# EAGLE design 16197 (EAGLE 7.6.0)
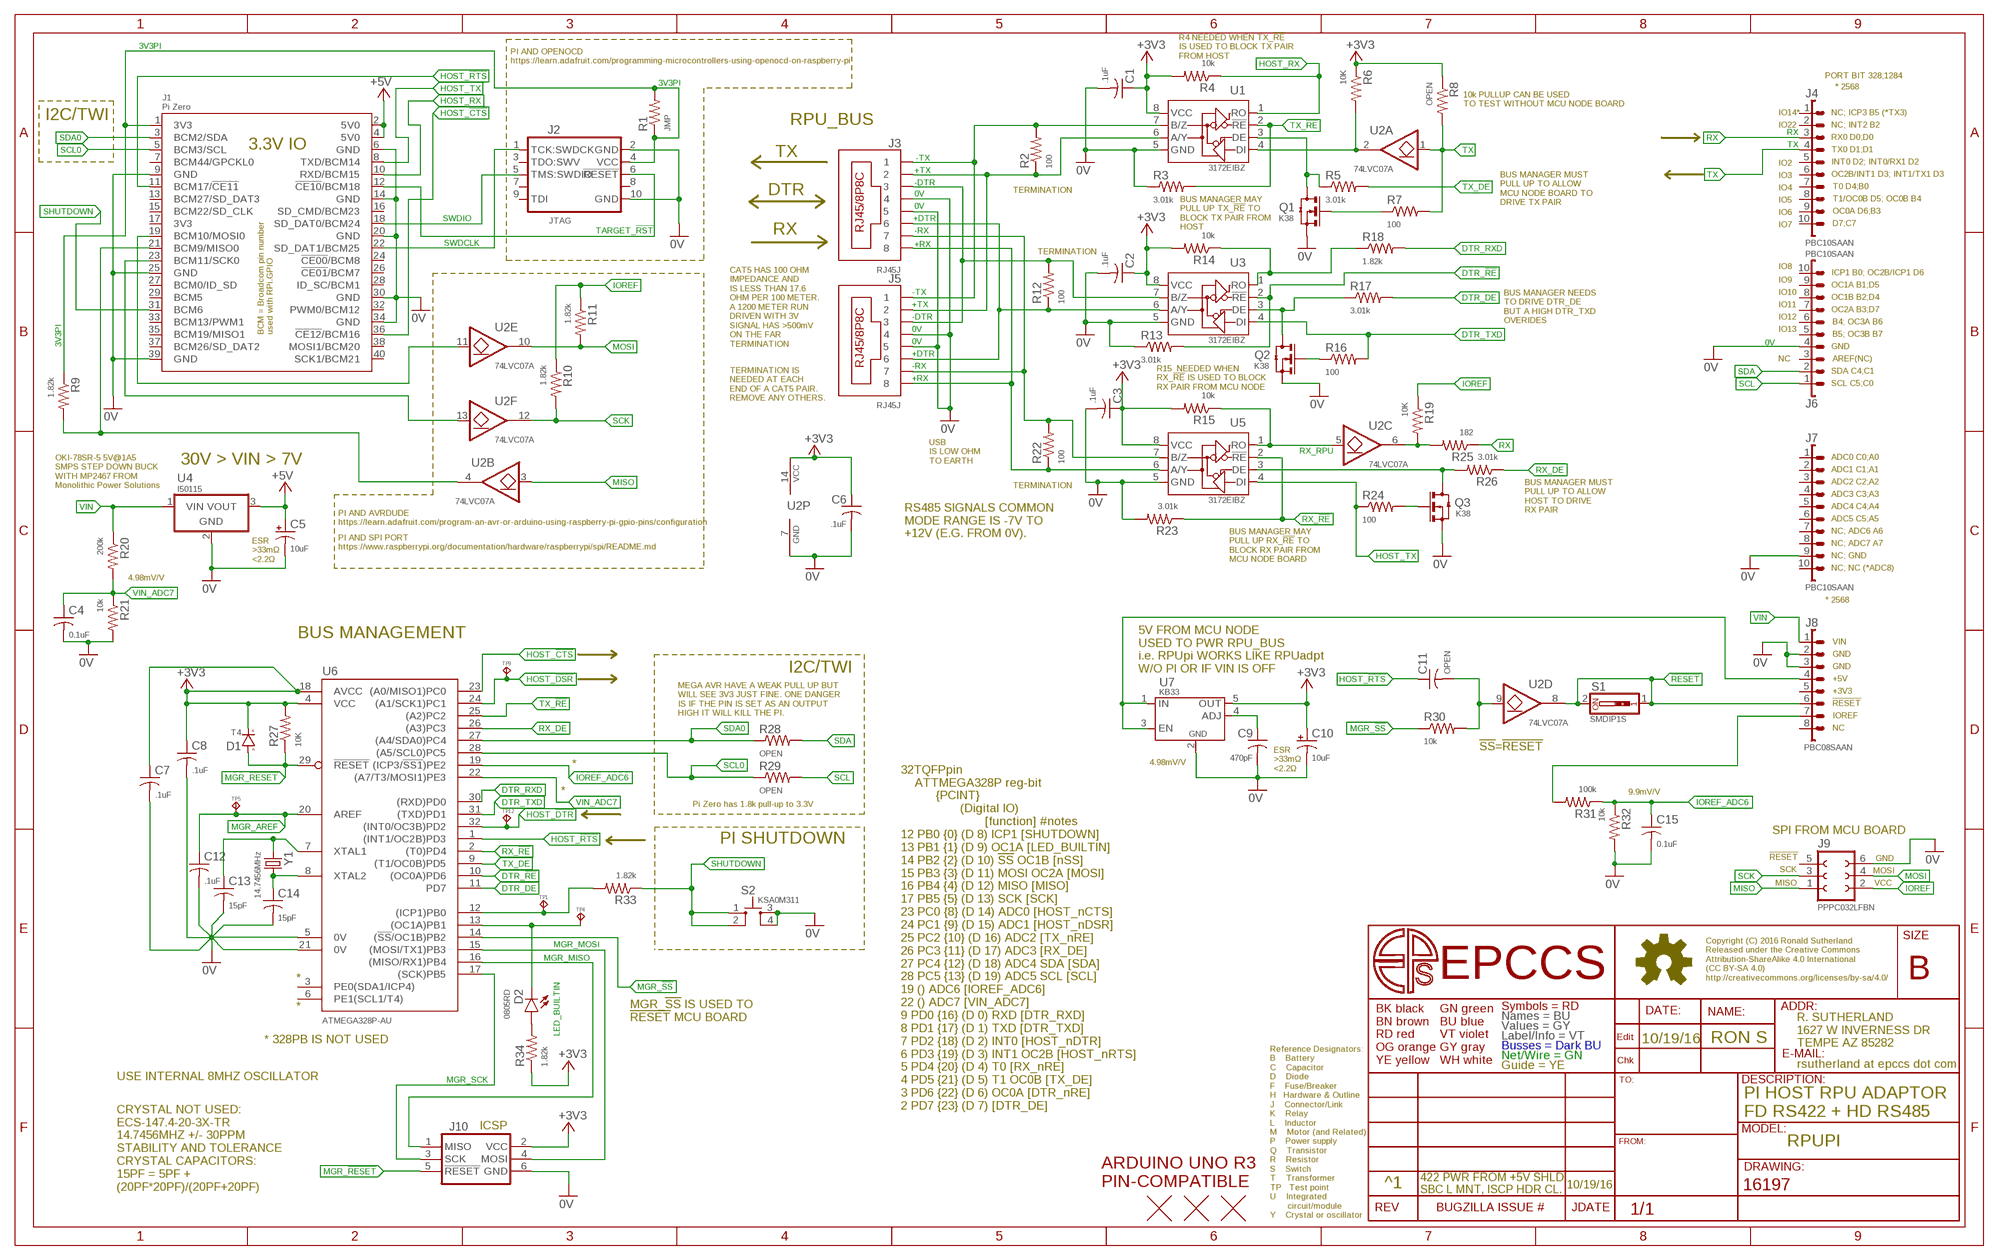
[diagram p0: schematic, sheet 1]

## Parts
C1  .1uF  CC0603A  [C0603(1608)]
C2  .1uF  CC0603A  [C0603(1608)]
C3  .1uF  CC0603A  [C0603(1608)]
C4  0.1uF  CC0603A  [C0603(1608)]
C5  10uF  CT1206  [3216]
C6  .1uF  CC0603A  [C0603(1608)]
C7  .1uF  CC0603A  [C0603(1608)]
C8  .1uF  CC0603A  [C0603(1608)]
C9  470pF  CC0603A  [C0603(1608)]
C10  10uF  CT1206  [3216]
C11  OPEN  CC0805A  [C0805(2012)]
C12  .1uF  CC0603A  [C0603(1608)]
C13  15pF  CC0603A  [C0603(1608)]
C14  15pF  CC0603A  [C0603(1608)]
C15  0.1uF  CC0603A  [C0603(1608)]
D1  T4  DSOD123  [SOD123]
D2  0805RD  LEDC0805(2012)  [C0805(2012)]
J1  Pi Zero  RPI-ZERO90  [RASPI_ZERO_V40PIN]
J2  JTAG  JTAG_SWD  [JTAG]
J3  RJ45J  RJ45-8HZT  [RJ45-8HZT]
J4  PBC10SAAN  1X10"  [1X10]
J5  RJ45J  RJ45-8HZT  [RJ45-8HZT]
J6  PBC10SAAN  1X10"  [1X10]
J7  PBC10SAAN  1X10"  [1X10]
J8  PBC08SAAN  1X8"  [1X8]
J9  PPPC032LFBN  F2X3  [F2X3]
J10  ISP-SPIPTH  [ISP]
Q1  K38  N-CHSOT23  [SOT23]
Q2  K38  N-CHSOT23  [SOT23]
Q3  K38  N-CHSOT23  [SOT23]
R1  JMP  R0805  [C0805(2012)]
R2  100  R0805  [C0805(2012)]
R3  3.01k  R0805  [C0805(2012)]
R4  10k  R0805  [C0805(2012)]
R5  3.01k  R0805  [C0805(2012)]
R6  10K  R0805  [C0805(2012)]
R7  100  R0805  [C0805(2012)]
R8  OPEN  R0805  [C0805(2012)]
R9  1.82k  R0805  [C0805(2012)]
R10  1.82k  R0805  [C0805(2012)]
R11  1.82k  R0805  [C0805(2012)]
R12  100  R0805  [C0805(2012)]
R13  3.01k  R0805  [C0805(2012)]
R14  10k  R0805  [C0805(2012)]
R15  10k  R0805  [C0805(2012)]
R16  100  R0805  [C0805(2012)]
R17  3.01k  R0805  [C0805(2012)]
R18  1.82k  R0805  [C0805(2012)]
R19  10K  R0805  [C0805(2012)]
R20  200k  R0805  [C0805(2012)]
R21  10k  R0805  [C0805(2012)]
R22  100  R0805  [C0805(2012)]
R23  3.01k  R0805  [C0805(2012)]
R24  100  R0805  [C0805(2012)]
R25  182  R0805  [C0805(2012)]
R26  3.01k  R0805  [C0805(2012)]
R27  10K  R0805  [C0805(2012)]
R28  OPEN  R0805  [C0805(2012)]
R29  OPEN  R0805  [C0805(2012)]
R30  10k  R0805  [C0805(2012)]
R31  100k  R0805  [C0805(2012)]
R32  10k  R0805  [C0805(2012)]
R33  1.82k  R0805  [C0805(2012)]
R34  1.82k  R0805  [C0805(2012)]
S1  SMDIP1S  SW_DIP-1SMD  [SMD-DIPSWITCH-1]
S2  KSA0M311  [0M311]
TP1  TPPAD1-08  [P1-08]
TP4  TPPAD1-08  [P1-08]
TP5  TPPAD1-08  [P1-08]
TP9  TPPAD1-08  [P1-08]
TP12  TPPAD1-08  [P1-08]
U1  3172EIBZ  ISL3172EIBZ  [SOIC8]
U2  74LVC07A  7407D  [14SOIC]
U3  3172EIBZ  ISL3172EIBZ  [SOIC8]
U4  I50115  OKI-78SR-H  [OKI-78SR-H]
U5  3172EIBZ  ISL3172EIBZ  [SOIC8]
U6  ATMEGA328P-AU  ATMEGA328PB-AU  [TQFP32-08]
U7  KB33  MIC5205  [SOT23-5,SOT25]
U$1  ARDUINO-UNO  [ARDUINO_UNO]
U$2  FIDUCIAL1.27  [FIDUCIAL-1.27]
U$3  FIDUCIAL1.27  [FIDUCIAL-1.27]
U$4  FIDUCIAL1.27  [FIDUCIAL-1.27]
Y1  14.7456MHz  CSM-3X  [CSM-3X]

## Nets
0V: C1.2 C2.2 C3.2 C4.2 C5.- C6.2 C7.2 C8.2 C9.2 C10.- C12.2 C13.2 C14.2 C15.2 J1.6(GND) J1.9(GND) J1.14(GND) J1.20(GND) J1.25(GND) J1.30(GND) J1.34(GND) J1.39(GND) J2.2(GND) J2.10(GND) J3.4 J3.5 J5.4 J5.5 J6.4 J7.9 J8.2 J8.3 J9.6 J10.6(GND) Q1.2(S)(S) Q2.2(S)(S) Q3.2(S)(S) R3.1 R13.1 R21.2 R23.2 R32.2 S2.3 S2.4 U1.5(GND) U2.7(P:GND) U3.5(GND) U4.2(GND) U5.5(GND) U6.5(0V) U6.21(0V) U7.2(GND)
3V3PI: J1.1(3V3) J2.4(VCC) R1.1 R1.2 R9.1
!RESET: J8.6 S1.1 S1.2 U2.8(D:O)
+3V3: C1.1 C2.1 C3.1 C6.1 C7.1 C8.1 C10.+ D1.C(K) J10.2(VCC) R4.2 R6.1 R8.1 R14.2 R15.2 R27.2 R34.1 U1.8(VCC) U2.14(P:VCC) U3.8(VCC) U5.8(VCC) U6.4(VCC) U6.18(AVCC) U7.5(OUT)
+5V: C5.+ J1.2(5V0) J1.4(5V0) U4.3(VOUT)
+DTR: J3.6 J5.6 R12.1 U3.6(A/Y)
+RX: J3.8 J5.8 R22.1 U5.6(A/Y)
+TX: J3.2 J5.2 R2.1 U1.6(A/Y)
-DTR: J3.3 J5.3 R12.2 U3.7(B/Z)
-RX: J3.7 J5.7 R22.2 U5.7(B/Z)
-TX: J3.1 J5.1 R2.2 U1.7(B/Z)
DTR_!RE: R13.2 U3.2(!RE) U6.10((OC0A)PD6)
DTR_DE: R17.2 U6.11(PD7)
DTR_RXD: R18.2 U6.30((RXD)PD0)
DTR_TXD: R16.2 U3.4(DI) U6.31((TXD)PD1)
HOST_!CTS: J1.36(!CE12!/BCM16) U6.23((A0/MISO1)PC0)
HOST_!DSR: TP9.TP U6.24((A1/SCK1)PC1)
HOST_!DTR: TP12.TP U6.32((INT0/OC3B)PD2)
HOST_!RTS: C11.1 J1.11(BCM17/!CE11!) U6.1((INT1/OC2B)PD3)
HOST_MISO: J1.21(BCM9/MISO0) R9.2 U2.4(B:O)
HOST_MOSI: J1.19(BCM10/MOSI0) U2.11(E:I)
HOST_RX: J1.10(RXD/BCM15) R4.1 U1.1(RO)
HOST_SCK: J1.23(BCM11/SCK0) U2.13(F:I)
HOST_TX: J1.8(TXD/BCM14) R24.1 U5.4(DI)
ICP1: R33.2 TP1.TP U6.12((ICP1)PB0)
IOREF: J9.2 R10.1 R11.1 R19.1
IOREF_ADC6: C15.1 R31.1 R32.1 U6.19((ICP3/!SS1!)PE2)
LED_BUILTIN: D2.K TP4.TP U6.13((OC1A)PB1)
MGR_!RESET: D1.A J10.5(!RESET) R27.1 U6.29(!RESET)
MGR_!SS!: R30.1 U6.14((!SS!/OC1B)PB2)
MGR_AREF: C12.1 TP5.TP U6.20(AREF)
MGR_MISO: J10.1(MISO) U6.16((MISO/RX1)PB4)
MGR_MOSI: J10.4(MOSI) U6.15((MOSI/TX1)PB3)
MGR_SCK: J10.3(SCK) U6.17((SCK)PB5)
MISO: J9.1 U2.3(B:I)
MOSI: J9.4 R11.2 U2.10(E:O)
N$2: C11.2 R30.2 U2.9(D:I)
N$3: J8.7 R31.2
N$10: R19.2 R25.2 U2.6(C:O)
N$11: Q3.3(D)(D) R26.2 U5.3(DE)
N$15: Q1.1(G)(G) R7.1
N$18: Q1.3(D)(D) R5.1 U1.3(DE)
N$19: R14.1 R18.1 U3.1(RO)
N$20: Q2.3(D)(D) R17.1 U3.3(DE)
N$22: Q2.1(G)(G) R16.1
N$24: C9.1 U7.4(ADJ)
N$25: Q3.1(G)(G) R24.2
N$29: D2.A R34.2
NODE5V: J8.4 U7.1(IN) U7.3(EN)
RX: J4.3 R25.1
RX_!RE: R23.1 U5.2(!RE) U6.2((T0)PD4)
RX_DE: R26.1 U6.26((A3)PC3)
RX_RPU: R15.1 U2.5(C:I) U5.1(RO)
SCK: J9.3 R10.2 U2.12(F:O)
SCL: J6.1 R29.2
SCL0: J1.5(BCM3/SCL) R29.1 U6.28((A5/SCL0)PC5)
SDA: J6.2 R28.2
SDA0: J1.3(BCM2/SDA) R28.1 U6.27((A4/SDA0)PC4)
SHUTDOWN: J1.31(BCM6) R33.1 S2.1 S2.2
SWDCLK: J1.22(SD_DAT1/BCM25) J2.1(TCK:SWDCK)
SWDIO: J1.18(SD_DAT0/BCM24) J2.5(TMS:SWDIO)
TARGET_!RST!: J1.12(!CE10!/BCM18) J2.6(!RESET)
TX: J4.4 R7.2 R8.2 U2.1(A:I)
TX_!RE: R3.2 U1.2(!RE) U6.25((A2)PC2)
TX_DE: R5.2 U6.9((T1/OC0B)PD5)
TX_RPU: R6.2 U1.4(DI) U2.2(A:O)
VIN: J8.1 R20.1 U4.1(VIN)
VIN_ADC7: C4.1 R20.2 R21.1 U6.22((A7/T3/MOSI1)PE3)
XTAL1: C13.1 U6.7(XTAL1) Y1.1
XTAL2: C14.1 U6.8(XTAL2) Y1.2
Unconnected: J1.7(BCM44/GPCKL0) J1.13(BCM27/SD_DAT3) J1.15(BCM22/SD_CLK) J1.16(SD_CMD/BCM23) J1.17(3V3) J1.24(!CE00!/BCM8) J1.26(!CE01!/BCM7) J1.27(BCM0/ID_SD) J1.28(ID_SC/BCM1) J1.29(BCM5) J1.32(PWM0/BCM12) J1.33(BCM13/PWM1) J1.35(BCM19/MISO1) J1.37(BCM26/SD_DAT2) J1.38(MOSI1/BCM20) J1.40(SCK1/BCM21) J2.3(TDO:SWV) J2.7(NC) J2.8(TRST) J2.9(TDI) J4.1 J4.2 J4.5 J4.6 J4.7 J4.8 J4.9 J4.10 J6.3 J6.5 J6.6 J6.7 J6.8 J6.9 J6.10 J7.1 J7.2 J7.3 J7.4 J7.5 J7.6 J7.7 J7.8 J7.10 J8.5 J8.8 J9.5 U6.3(PE0(SDA1/ICP4)) U6.6(PE1(SCL1/T4))

## Notes on the sheet
- R4 NEEDED WHEN TX_!RE! 
  IS USED TO BLOCK TX PAIR 
  FROM HOST
- PI AND OPENOCD
  https://learn.adafruit.com/programming-microcontrollers-using-openocd-on-raspberry-pi
- PORT BIT 328;1284
- * 2568
- 10k PULLUP CAN BE USED 
  TO TEST WITHOUT MCU NODE BOARD
- IO14* | NC; ICP3 B5 (*TX3)
- I2C/TWI
- RPU_BUS | IO22 | NC; INT2 B2
- RX0 D0;D0
- TX0 D1;D1
- TX
- IO2 | INT0 D2; INT0/RX1 D2
- IO3 | OC2B/INT1 D3; INT1/TX1 D3
- IO4 | T0 D4;B0
- DTR | TERMINATION
- IO5 | T1/OC0B D5; OC0B B4
- BUS MANAGER MUST
  PULL UP TO ALLOW 
  MCU NODE BOARD TO 
  DRIVE TX PAIR
- IO6 | OC0A D6;B3
- IO7 | D7;C7
- BUS MANAGER MAY
  PULL UP TX_!RE! TO 
  BLOCK TX PAIR FROM 
  HOST
- RX
- TERMINATION
- IO8
- ICP1 B0; OC2B/ICP1 D6
- IO9
- OC1A B1;D5
- IO10
- OC1B B2;D4
- IO11
- OC2A B3;D7
- IO12
- BUS MANAGER NEEDS
  TO DRIVE DTR_DE
  BUT A HIGH DTR_TXD
  OVERIDES
- B4; OC3A B6
- IO13
- B5; OC3B B7
- CAT5 HAS 100 OHM 
  IMPEDANCE AND 
  IS LESS THAN 17.6 
  OHM PER 100 METER. 
  A 1200 METER RUN
  DRIVEN WITH 3V 
  SIGNAL HAS >500mV
  ON THE FAR
  TERMINATION
- GND
- NC | AREF(NC)
- SDA C4;C1
- SCL C5;C0
- R15  NEEDED WHEN 
  RX_!RE! IS USED TO BLOCK 
  RX PAIR FROM MCU NODE
- TERMINATION IS 
  NEEDED AT EACH
  END OF A CAT5 PAIR.
  REMOVE ANY OTHERS.
- ADC0 C0;A0
- USB
  IS LOW OHM
  TO EARTH
- 30V > VIN > 7V
- ADC1 C1;A1
- ADC2 C2;A2
- OKI-78SR-5 5V@1A5
  SMPS STEP DOWN BUCK
  WITH MP2467 FROM 
  Monolithic Power Solutions
- TERMINATION
- ADC3 C3;A3
- ADC4 C4;A4
- BUS MANAGER MUST
  PULL UP TO ALLOW 
  HOST TO DRIVE
  RX PAIR
- ADC5 C5;A5
- PI AND AVRDUDE
  https://learn.adafruit.com/program-an-avr-or-arduino-using-raspberry-pi-gpio-pins/configuration
- NC; ADC6 A6
- RS485 SIGNALS COMMON 
  MODE RANGE IS -7V TO 
  +12V (E.G. FROM 0V).
- NC; ADC7 A7
- PI AND SPI PORT
  https://www.raspberrypi.org/documentation/hardware/raspberrypi/spi/README.md
- NC; GND
- ESR
  >33mΩ
  <2.2Ω
- BUS MANAGER MAY
  PULL UP RX_!RE! TO 
  BLOCK RX PAIR FROM
  MCU NODE BOARD
- NC; NC (*ADC8)
- 4.98mV/V
- * 2568
- BUS MANAGEMENT
- VIN
- GND
- GND
- I2C/TWI
- 5V FROM MCU NODE
  USED TO PWR RPU_BUS
  i.e. RPUpi WORKS LIKE RPUadpt
  W/O PI OR IF VIN IS OFF
- +5V
- +3V3
- !RESET
- MEGA AVR HAVE A WEAK PULL UP BUT 
  WILL SEE 3V3 JUST FINE. ONE DANGER 
  IS IF THE PIN IS SET AS AN OUTPUT 
  HIGH IT WILL KILL THE PI.
- IOREF
- NC
- !SS!=!RESET!
- * | 4.98mV/V
- ESR
  >33mΩ
  <2.2Ω
- * | 9.9mV/V
- Pi Zero has 1.8k pull-up to 3.3V
- SPI FROM MCU BOARD
- PI SHUTDOWN
- !RESET
- GND
- SCK
- MOSI
- MISO
- VCC
- *
- *
- MGR_!SS! IS USED TO
  !RESET! MCU BOARD
- * 328PB IS NOT USED | 10/19/16 | RON S
- USE INTERNAL 8MHZ OSCILLATOR
- 32TQFPpin
      ATTMEGA328P reg-bit
            {PCINT}
                   (Digital IO)
                          [function] #notes
  12 PB0 {0} (D 8) ICP1 [SHUTDOWN]
  13 PB1 {1} (D 9) OC1A [LED_BUILTIN]
  14 PB2 {2} (D 10) !SS! OC1B [nSS]
  15 PB3 {3} (D 11) MOSI OC2A [MOSI]
  16 PB4 {4} (D 12) MISO [MISO]
  17 PB5 {5} (D 13) SCK [SCK]
  23 PC0 {8} (D 14) ADC0 [HOST_nCTS]
  24 PC1 {9} (D 15) ADC1 [HOST_nDSR]
  25 PC2 {10} (D 16) ADC2 [TX_nRE]
  26 PC3 {11} (D 17) ADC3 [RX_DE]
  27 PC4 {12} (D 18) ADC4 SDA [SDA]
  28 PC5 {13} (D 19) ADC5 SCL [SCL]
  19 () ADC6 [IOREF_ADC6]
  22 () ADC7 [VIN_ADC7]
  9 PD0 {16} (D 0) RXD [DTR_RXD]
  8 PD1 {17} (D 1) TXD [DTR_TXD]
  7 PD2 {18} (D 2) INT0 [HOST_nDTR]
  6 PD3 {19} (D 3) INT1 OC2B [HOST_nRTS]
  5 PD4 {20} (D 4) T0 [RX_nRE]
  4 PD5 {21} (D 5) T1 OC0B [TX_DE]
  3 PD6 {22} (D 6) OC0A [DTR_nRE]
  2 PD7 {23} (D 7) [DTR_DE]
- PI HOST RPU ADAPTOR 
  FD RS422 + HD RS485
- ICSP
- RPUPI
- ^1 | 10/19/16
- CRYSTAL NOT USED:
  ECS-147.4-20-3X-TR
  14.7456MHZ +/- 30PPM
  STABILITY AND TOLERANCE
  CRYSTAL CAPACITORS:
  15PF = 5PF +
  (20PF*20PF)/(20PF+20PF)
- 422 PWR FROM +5V SHLD,
  SBC L MNT, ISCP HDR CL.

## Library data of the parts
C1-C4 C6-C9 C11-C15 = C-C:C: CAPACITOR Symbol
C5 C10 = C-T:CT: Tantalum Electrolytic Capacitor
D1 = D-GP:D: DIODE
D2 = D-LED:LED: LED 120120WH [CREE,XHGAWT-00-0000-00000HXE1] LED WHITE 6500K 150LUM-W120120
J1 = U-Pi:RPI-ZERO: Raspberry Pi Zero https://pinout.xyz/ NOTE: WiFi is needed see https://www.kickstarter.com/projects/1991736672/iot-hat-for-raspberry-pi-a-must-have-for-pi-zero
J2 = U-ARM:JTAG_SWD: JTAG layout that Atmel used for Atmel-ICE which works for both AVR and ARM devices
J3 J5 = J-RJ45:RJ45-8: RJ45 Jack RJ45J [ASSMANN,A-2014-2-4-R] JACK MODULAR VERT PCB 8P8C UNSHIELD Horz version form sparkfun sku PRT-00643, and breakout board sku is BOB-00716.
J4 J6 J7 = J-HDR2.54mm:1X10: 10 POS HEADER PBC10S [SULLINS,PBC10SAAN]HEADER MALE BRKWAY 10POS .1IN AA
J8 = J-HDR2.54mm:1X8: 8 POS HEADER PBC08SAAN [SULLINS,PBC08SAAN]HEADER MALE BRKWAY 8POS .1IN AA
J9 = J-HDR2.54mm:F2X3: FEMALE HEADER 2X3POS
J10 = U-AVR:ISP-SPI: AVR ISP thru SPI In-System Programming uses the target Atmel AVR’s internal SPI (Serial Peripheral Interface) to download code into the flash and EEPROM memories. It is not a debugging interface. When designing an application PCB which includes an AVR with the SPI interface, this pinout should be used. Sparkfun SKU: BOB-08508
Q1-Q3 = Q-NCH:N-CH?*: ENHANCEMENT MODE MOSFET SOT23 is BSS138 pinout
R1-R34 = R-C:R: Resiistor American-style symbol
S1 = S-Toggle:SW_DIP-1
S2 = S-Tactile:KSA: KSA0M311 [C&K,KSA0M311LFT] SWITCH TACTILE SEALED SPST-NO 50MA 32V
TP1 TP4 TP5 TP9 TP12 = J-TP:TP: Test pad
U1 U3 U5 = U-Transceiver:ISL3172E: TRANSCEIVER RS485 3.3V HALFDPLX
U2 = U-7400:74*07: HEX BUFFER, OPEN DRAIN/COLLECTOR 74LVC07A [DIODES,74LVC07AS14-13] LOGIC BUFFER OPEN DRAIN 14SOIC
U4 = P-DCDC:OKI-78SR: OKI-78SR OKI-78SR-5/1.5-W36H-C 5V@1.5A Horizontal Mount OKI-78SR-5/1.5-W36-C 5V@1.5A Vert Mount OKI-78SR-3.3/1.5-W36H-C 3.3V@1.5A Horizontal Mount OKI-78SR-3.3/1.5-W36-C 3.3V@1.5A Vert Mount Murata Power Solutions 7 to 36 VDC input range need to verify pinout
U6 = U-AVR:ATMEGA328PB-AU: ATmega328PB 4 Kbytes FLASH 128 bytes SRAM 256 bytes EEPROM 2 UART, 2 I2C, 2 SPI 8-channel 10 bit ADC
U7 = P-DCDC:MIC5205: KB33 [MICREL,MIC5205-3.3YM5] REG ULDO 3V3 150MA SOT23-5
U$1 = J-BoardHDR:ARDUINO-UNO: Board Outline with holes and silk note the board dim layer is not defined
U$2-U$4 = H-Fiducial:FIDUCIAL: Fiducial Alignment Points Various fiducial points for machine vision alignment.
Y1 = Y-XTL:CSM: 16MHZ20 [ECS,ECS-160-20-3X-TR] CRYSTAL 16MHZ 20PF 30PPM CSM-3X

## Net classes
0 default: width 0.254 mm, drill 0.33 mm

## Board
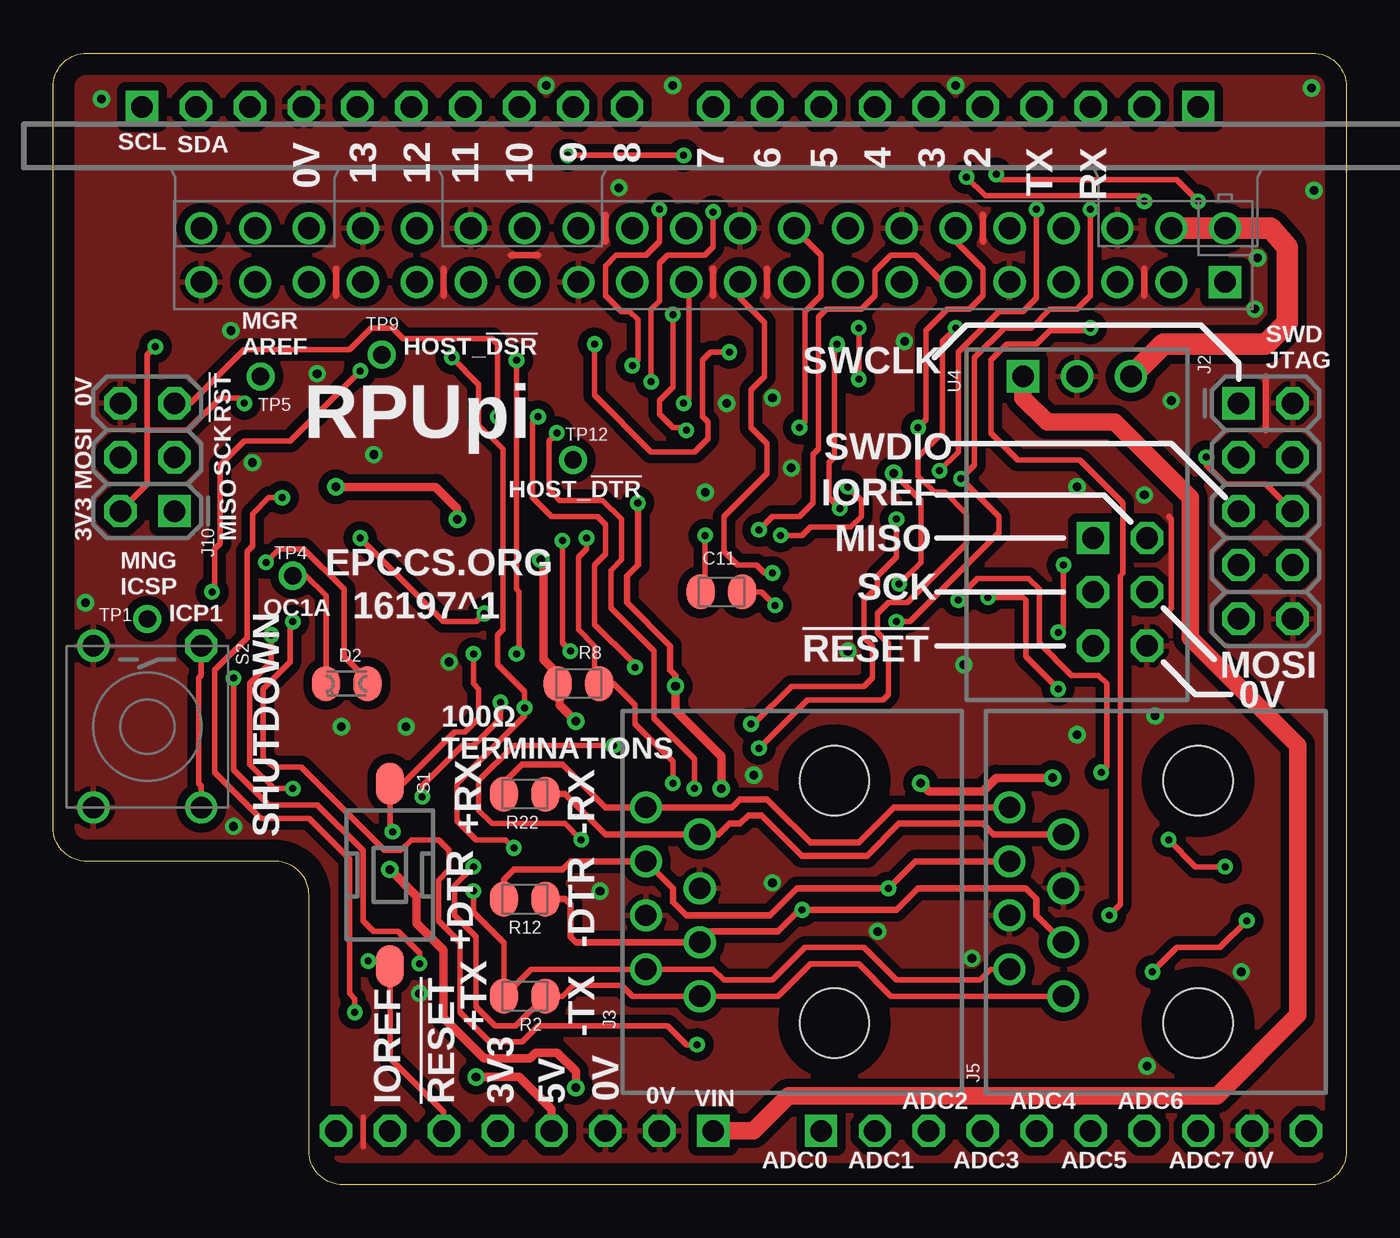
[diagram p1: board, top side]
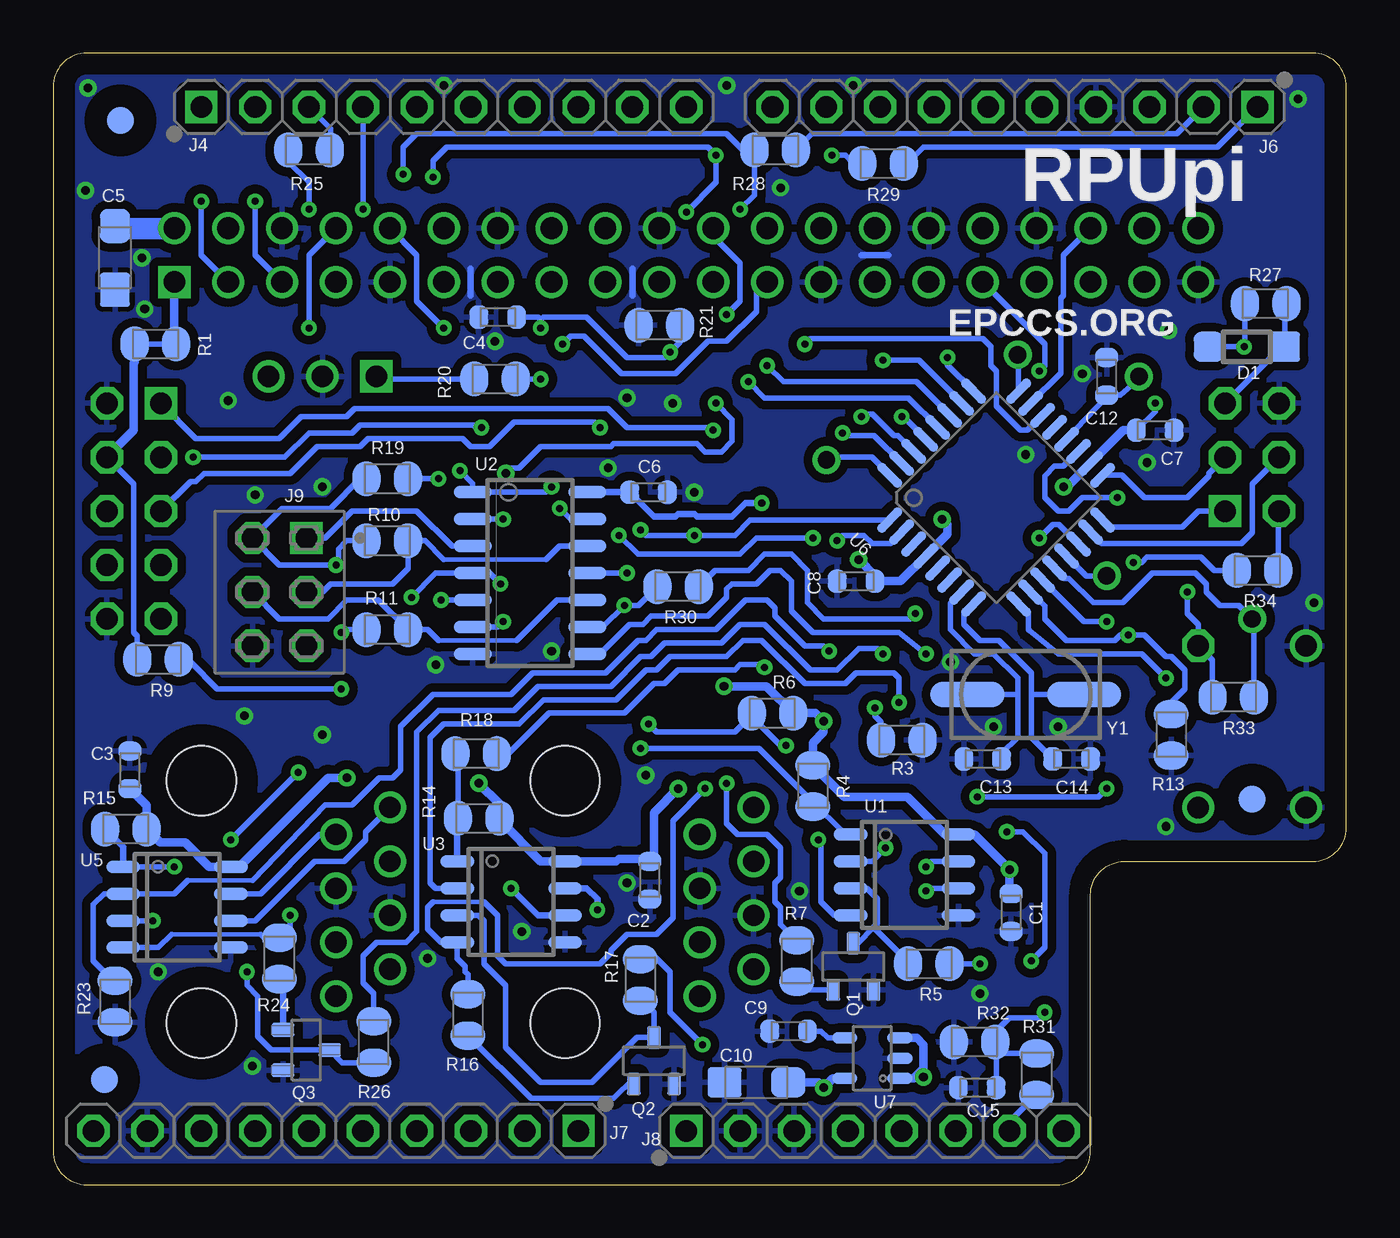
[diagram p2: board, bottom side, seen from below]

Size 60.96 x 53.34 mm. Coordinates in mm from the lower left corner, seen from the top.
Outline: 60.96,51.75 60.96,1.59 arc-90 59.37,0 13.65,0 arc-90 12.06,1.59 12.06,13.65 arc90 10.48,15.24 1.59,15.24 arc-90 0,16.83 0,51.75 arc-90 1.59,53.34 59.37,53.34 arc-90 60.96,51.75
Copper layers (1*16): Top 0.034290625mm / dielectric 60mil / Bottom 0.034290625mm
Design rules "default *": minimum track width 10mil, minimum drill 13mil, track to track 8mil, track to pad 8mil, pad to pad 8mil, via to via 8mil, smd to smd 8mil, copper to edge 40mil, drill to drill 12mil, minimum pad ring 10mil, minimum via ring 8mil, stop-mask expansion 4mil, vias tented up to drill 17mil, thermal gap 10mil

### Footprints (pad centres in the part's own frame; a part is rotated, then mirrored left to right if it is on the bottom)
C0603(1608) = smd 0.898 x 1.1: 1 -0.889,0; 2 0.889,0
3216 = smd 1.6 x 1.4: + -1.5,0; - 1.5,0
C0805(2012) = smd 1.321 x 1.651: 1 -0.977,0; 2 0.977,0
SOD123 = smd 1.4 x 1.4: A 1.8,0; C -1.8,0
C0805(2012)' = smd 1.321 x 1.651: A 0.977,0; K -0.977,0
RASPI_ZERO_V40PIN = drill 1.016 square: 1 0,2.54 | drill 1.016: 2 0,0; 3 2.54,2.54; 4 2.54,0; 5 5.08,2.54; 6 5.08,0; 7 7.62,2.54; 8 7.62,0; 9 10.16,2.54; 10 10.16,0; 11 12.7,2.54; 12 12.7,0; 13 15.24,2.54; 14 15.24,0; 15 17.78,2.54; 16 17.78,0; 17 20.32,2.54; 18 20.32,0; 19 22.86,2.54; 20 22.86,0; 21 25.4,2.54; 22 25.4,0; 23 27.94,2.54; 24 27.94,0; 25 30.48,2.54; 26 30.48,0; 27 33.02,2.54; 28 33.02,0; 29 35.56,2.54; 30 35.56,0; 31 38.1,2.54; 32 38.1,0; 33 40.64,2.54; 34 40.64,0; 35 43.18,2.54; 36 43.18,0; 37 45.72,2.54; 38 45.72,0; 39 48.26,2.54; 40 48.26,0
JTAG = drill 1.016 square: 1 0,0 | drill 1.016 octagon: 2 0,2.54; 3 2.54,0; 4 2.54,2.54; 5 5.08,0; 6 5.08,2.54; 7 7.62,0; 8 7.62,2.54; 9 10.16,0; 10 10.16,2.54
RJ45-8HZT = drill 1: 1 -4.445,6.35; 2 -3.175,8.89; 3 -1.905,6.35; 4 -0.635,8.89; 5 0.635,6.35; 6 1.905,8.89; 7 3.175,6.35; 8 4.445,8.89 | hole 3.264: -5.715,0; 5.715,0
1X10 = drill 1.016 square: 1 0,0 | drill 1.016 octagon: 2 2.54,0; 3 5.08,0; 4 7.62,0; 5 10.16,0; 6 12.7,0; 7 15.24,0; 8 17.78,0; 9 20.32,0; 10 22.86,0
1X8 = drill 1.016 square: 1 0,0 | drill 1.016 octagon: 2 2.54,0; 3 5.08,0; 4 7.62,0; 5 10.16,0; 6 12.7,0; 7 15.24,0; 8 17.78,0
F2X3 = drill 1.016 square: 1 0,0 | drill 1.016 octagon: 2 0,-2.54; 3 2.54,0; 4 2.54,-2.54; 5 5.08,0; 6 5.08,-2.54
ISP = drill 1.016 square: 1 0,0 | drill 1.016 octagon: 2 0,2.54; 3 2.54,0; 4 2.54,2.54; 5 5.08,0; 6 5.08,2.54
SOT23 = smd 0.65 x 1.06: 1(G) -0.95,-1.1; 2(S) 0.95,-1.1; 3(D) 0,1.1
SMD-DIPSWITCH-1 = smd 1.3 x 2: 1 0,-4.3; 2 0,4.3
0M311 = drill 1.016 octagon: 1 -3.81,2.54 | drill 1.016: 2 3.81,2.54; 3 -3.81,-2.54; 4 3.81,-2.54
P1-08 = drill 0.813: TP 0,0
SOIC8 = smd 0.6 x 1.6: 1 -1.905,-2.54; 2 -0.635,-2.54; 3 0.635,-2.54; 4 1.905,-2.54; 5 1.905,2.54; 6 0.635,2.54; 7 -0.635,2.54; 8 -1.905,2.54
14SOIC = smd 0.6 x 1.8: 1 -3.81,-2.7; 2 -2.54,-2.7; 3 -1.27,-2.7; 4 0,-2.7; 5 1.27,-2.7; 6 2.54,-2.7; 7 3.81,-2.7; 8 3.81,2.7; 9 2.54,2.7; 10 1.27,2.7; 11 0,2.7; 12 -1.27,2.7; 13 -2.54,2.7; 14 -3.81,2.7
OKI-78SR-H = drill 1.016 square: 1 0,0 | drill 1.016: 2 -2.54,0; 3 -5.08,0
TQFP32-08 = smd 1.5 x 0.45: 1 -4.293,2.8; 2 -4.293,2; 3 -4.293,1.2; 4 -4.293,0.4; 5 -4.293,-0.4; 6 -4.293,-1.2; 7 -4.293,-2; 8 -4.293,-2.8; 17 4.293,-2.8; 18 4.293,-2; 19 4.293,-1.2; 20 4.293,-0.4; 21 4.293,0.4; 22 4.293,1.2; 23 4.293,2; 24 4.293,2.8 | smd 0.45 x 1.5: 9 -2.8,-4.293; 10 -2,-4.293; 11 -1.2,-4.293; 12 -0.4,-4.293; 13 0.4,-4.293; 14 1.2,-4.293; 15 2,-4.293; 16 2.8,-4.293; 25 2.8,4.293; 26 2,4.293; 27 1.2,4.293; 28 0.4,4.293; 29 -0.4,4.293; 30 -1.2,4.293; 31 -2,4.293; 32 -2.8,4.293
SOT23-5,SOT25 = smd 0.55 x 1.2: 1 -0.95,-1.3; 2 0,-1.3; 3 0.95,-1.3; 4 0.95,1.3; 5 -0.95,1.3
FIDUCIAL-1.27 = smd 1.27 x 1.27: 1 0,0
CSM-3X = smd 3.5 x 1.2: 1 -2.75,0; 2 2.75,0

### Placement (x,y rotation side)
C1  15.81,12.83 270 bottom
C2  32.83,14.35 270 bottom
C3  57.34,19.56 90 bottom
C4  40,40.89 180 bottom
C5  58.04,43.69 270 bottom
C6  32.89,32.64 0 bottom
C7  9.02,35.56 0 bottom
C8  23.11,28.45 180 bottom
C9  26.29,7.24 180 bottom
C10  27.81,4.83 180 bottom
C11  31.5,27.94 0 top
C12  11.3,38.1 90 bottom
C13  17.15,20.07 180 bottom
C14  12.95,20.07 0 bottom
C15  17.4,4.57 180 bottom
D1  4.7,39.5 0 bottom
D2  0805RD  [C0805(2012)']  13.84,23.62 0 top
J1  55.24,45.09 180 top
J2  55.88,36.83 270 top
J3  36.83,13.34 90 top
J4  53.98,50.8 0 bottom
J5  53.98,13.34 90 top
J6  4.19,50.8 180 bottom
J7  36.2,2.54 180 bottom
J8  31.12,2.54 0 bottom
J9  49.02,30.48 270 bottom
J10  5.71,31.75 90 top
Q1  23.24,10.29 0 bottom
Q2  32.64,5.84 0 bottom
Q3  49.02,6.35 270 bottom
R1  56.13,39.62 0 bottom
R2  22.23,8.89 0 top
R3  20.96,20.95 180 bottom
R4  25.15,18.8 90 bottom
R5  19.69,10.41 0 bottom
R6  27.05,22.23 180 bottom
R7  25.91,10.54 90 bottom
R8  24.77,23.62 0 top
R9  56.01,24.77 0 bottom
R10  45.21,30.35 0 bottom
R11  45.21,26.16 0 bottom
R12  22.23,13.46 0 top
R13  8.26,21.21 90 bottom
R14  40.89,17.27 0 bottom
R15  57.53,16.76 0 bottom
R16  41.4,8 90 bottom
R17  33.27,9.65 90 bottom
R18  41.02,20.32 0 bottom
R19  45.21,33.27 0 bottom
R20  40.13,37.97 0 bottom
R21  32.38,40.51 180 bottom
R22  22.23,18.41 0 top
R23  58.04,8.64 270 bottom
R24  50.29,10.67 270 bottom
R25  48.89,48.77 180 bottom
R26  45.85,6.73 270 bottom
R27  3.81,41.53 180 bottom
R28  26.92,48.77 0 bottom
R29  21.84,48.13 0 bottom
R30  31.5,28.19 180 bottom
R31  14.61,5.21 270 bottom
R32  17.53,6.73 180 bottom
R33  5.33,22.99 0 bottom
R34  4.19,28.96 180 bottom
S1  15.88,14.61 0 top
S2  4.45,21.59 270 top
TP1  4.45,26.67 0 top
TP4  11.3,28.7 0 top
TP5  9.78,38.1 0 top
TP9  15.49,39.12 0 top
TP12  24.51,34.16 0 top
U1  20.83,14.61 270 bottom
U2  38.48,28.83 270 bottom
U3  39.37,13.34 270 bottom
U4  45.72,38.1 180 top
U5  55.12,13.08 270 bottom
U6  16.51,32.38 45 bottom
U7  22.35,5.97 90 bottom
U$1  -14.61,0 0 top  (outside the outline)
U$2  57.78,50.16 0 bottom
U$3  4.45,18.16 0 bottom
U$4  58.55,4.95 0 bottom
Y1  15.11,23.11 0 bottom

### Tracks (layer width: path | path; a pad name or v marks a point on that pad's centre or on a via)
0V  (via drill 0.41)
  Top 0.254: 14.61,1.78 14.61,3.17 | 52.58,31.5 52.7,31.37 52.7,27.18 52.58,27.05
  Top 0.305: 57.15,35.56 57.15,38.1 | 22.86,43.81 21.59,43.81 | 31.12,43.18 31.12,41.91 | 33.66,43.18 33.66,41.91 | 43.81,45.72 43.81,44.45 | 51.43,43.18 51.43,41.91 | 13.33,43.18 13.33,41.91 | 18.42,43.18 18.42,41.91 | 26.04,45.72 26.04,44.45
  Bottom 0.305: 21.59,43.81 22.86,43.81 | 33.66,43.18 33.66,41.91 | 41.27,43.18 41.27,41.91
  other vias: 9.4,34.04 12.45,38.23 2.29,51.18 23.24,51.82 29.21,51.82 42.54,51.82 59.31,51.69 56.01,10.03 51.94,22.1 51.43,32.51 42.93,24.51 30.73,32.64 48.26,21.21 51.56,5.59 13.59,21.59 16.64,21.59 18.67,24.64 38.86,11.94 1.52,27.43 8.51,16.89 37.46,25.15 8.38,40.26 48.26,32.89 15.11,34.42 52.7,36.96 56.64,41.27 56.77,43.69 59.44,46.86 26.67,46.99 31.75,36.83 34.8,33.78 33.91,37.08 40.13,39.75 17.27,9.02 33.02,19.3 33.91,14.22 25.78,13.84 43.31,10.67
  pour Top (isolate 0.406): 11.43,0 11.43,14.61 0,14.61 0,53.34 60.96,53.34 60.96,0
  pour Bottom (isolate 0.406): 0,53.34 60.96,53.34 60.96,0 11.43,0 11.43,14.61 0,14.61
3V3PI
  Bottom 0.254: R1.2 R1.1 | R9.1 56.98,25.87 57.15,26.04 57.15,33.02 J2.4
  Bottom 0.406: J1.1 55.24,40.17 R1.2 | R1.1 57.11,38.77 57.15,38.73 57.15,35.56 J2.4
!RESET  (via drill 0.33)
  Top 0.254: J8.6 18.42,3.43 15.88,5.97 S1.1 15.6,10.3 15.49,10.54 v14.86,10.54 | v19.81,25.02 19.81,23.62 20.07,23.37 20.07,21.97 19.43,21.34 18.92,21.34 16.51,18.92 15.89,18.92 S1.2 15.88,16.76 v16,16.64
  Bottom 0.254: U2.8 35.18,25.02 33.78,26.42 33.15,26.42 32.77,26.8 30.1,26.8 29.21,27.69 29.21,28.07 28.96,28.32 27.81,28.32 27.18,28.96 26.67,28.96 26.16,28.45 26.16,27.05 25.15,26.04 21.08,26.04 v19.81,25.02 | v14.86,10.54 14.22,11.18 14.22,15.62 15.24,16.64 v16,16.64
+3V3  (via drill 0.33, 0.41)
  Top 0.254: v9.02,36.83 8.76,37.08 7.87,37.08 6.35,35.56 4.45,35.56 | 4.45,35.56 4.45,33.02 J10.2 | v4.83,39.5 4.45,39.12 4.45,35.56
  Top 0.305: 23.88,22.77 23.88,22.61 | v29.34,23.5 29.34,24 29.08,24.26 29.08,25.4 27.05,27.43 27.05,28.7 27.56,29.21 v27.56,32.13
  Top 0.406: 23.88,22.77 R8.1 23.79,24.09 23.11,24.77 23.11,29.34 v22.99,29.46 | 23.88,22.61 v24.64,21.84 | v24.64,4.57 24.64,5.33 23.75,6.22 22.73,6.22 22.48,5.97 20.32,5.97 18.42,7.87 18.42,11.05 17.15,12.32 17.15,13.59 v15.88,14.86 | v31.5,18.67 31.5,20.19 29.34,22.35 v29.34,23.5 | v13.33,32.89 18.03,32.89 19.05,31.88 v19.05,31.37 | v40.89,18.92 41.27,18.54 43.81,18.54 44.45,19.18 v47.12,19.18
  Bottom 0.254: R34.1 3.21,31.71 J10.2 | 32.89,15.37 33.53,15.37 | C7.1 9.02,36.45 v9.02,36.83 | R27.2 4.79,39.54 v4.83,39.5 D1.C
  Bottom 0.305: R14.2 39.92,17.18 | v27.56,32.13 28.32,32.13 28.96,31.5 30.61,31.5 30.73,31.62 31.5,31.62 31.62,31.5 32.64,31.5 C6.1 U2.14
  Bottom 0.406: C7.1 10.51,35.56 U6.18 13.17,32.89 v13.33,32.89 | 39.92,17.18 37.97,15.24 U3.8 34.42,15.24 34.29,15.37 32.89,15.37 | U7.5 24.19,5.02 v24.64,4.57 24.89,4.83 C10.+ | C1.1 15.88,13.78 v15.88,14.86 17.53,16.51 U1.8 18.92,16.51 20.7,18.29 23.66,18.29 R4.2 25.15,20.83 24.64,21.34 v24.64,21.84 25.02,22.23 R6.1 27.34,23.5 v29.34,23.5 | C2.1 32.89,15.37 | 32.89,15.37 32.64,15.62 32.64,17.53 v31.5,18.67 | 22.73,29.21 v22.99,29.46 22.23,28.7 C8.1 21.01,28.45 U6.4 18.8,30.66 18.8,31.11 v19.05,31.37 | R14.2 39.92,17.95 v40.89,18.92 | v47.12,19.18 48.01,19.18 52.2,14.99 U5.8 53.59,14.99 54.74,16.13 55.92,16.13 R15.2 56.55,17.88 C3.1 57.53,18.67
+5V
  Top 1.016: U4.3 52.32,39.62 57.15,39.62 58.17,40.64 58.17,44.2 57.4,45.09 J1.2 J1.4
  Bottom 1.016: C5.+ 58.04,45.21 57.89,45.06 55.27,45.06 J1.2
+DTR  (via drill 0.33)
  Top 0.305: J5.6 40.64,15.24 v39.37,13.97 35.05,13.97 33.78,12.7 29.85,12.7 29.21,13.34 29.21,13.97 J3.6 24.38,15.24 24,14.86 21.72,14.86 21.25,14.39 R12.1
  Bottom 0.305: U3.6 38.1,12.7 v39.37,13.97
+RX
  Top 0.254: R22.1 21.25,18.96
  Top 0.305: J5.8 39.62,17.78 37.97,16.13 35.69,16.13 34.04,17.78 33.66,18.16 32.38,18.16 32,17.78 J3.8 26.04,17.78 24,19.81 22.1,19.81 21.25,18.96
  Bottom 0.254: U5.6 51.43,12.45 48.64,15.24 47.24,15.24 46.23,16.26 46.23,16.64 J5.8
+TX  (via drill 0.33)
  Top 0.254: J5.2 44.2,10.16 43.69,9.65 39.75,9.65 38.23,11.18 35.43,11.18 33.91,9.65 31.62,9.65 31.12,10.16 J3.2 22.52,10.16 R2.1 21.25,11.39 19.81,12.83 v19.81,13.84
  Bottom 0.254: U1.6 19.69,13.97 v19.81,13.84
-DTR  (via drill 0.33)
  Top 0.305: J5.3 46.35,12.7 46.35,13.46 45.85,13.97 40.77,13.97 39.75,12.95 v35.31,12.95 35.18,12.95 34.16,11.94 30.99,11.94 J3.3 24.64,11.43 24.38,11.68 24.38,13.21 24.13,13.46 R12.2
  Bottom 0.305: U3.7 35.81,13.97 35.31,13.46 v35.31,12.95
-RX
  Top 0.305: R22.2 24.13,18.41 26.04,16.51 J3.7 31.37,16.51 31.88,17.02 32.38,17.02 32.77,17.4 33.4,17.4 35.31,15.49 38.35,15.49 39.88,17.02 43.81,17.02 44.32,16.51 J5.7
  Bottom 0.254: U5.7 51.18,13.72 48.39,16.51 J5.7
-TX  (via drill 0.33)
  Top 0.254: J5.1 39.5,8.89 37.97,10.41 35.69,10.41 34.16,8.89 J3.1 27.31,8.89 26.8,9.4 24.51,9.4 24,8.89 R2.2 21.81,7.49 20.83,7.49 19.94,8.38 19.94,11.68 18.92,12.7 18.92,14.1 v19.81,14.99
  Bottom 0.254: U1.7 19.56,15.24 v19.81,14.99
DTR_!RE  (via drill 0.33)
  Top 0.254: v21.08,22.73 21.08,21.97 19.81,20.7 19.3,20.7 17.4,18.8 v17.4,18.29 | v11.3,18.67 10.41,18.67 9.27,19.81 9.27,23.62 10.29,24.64 v10.29,25.91
  Bottom 0.254: U3.2 42.93,13.97 43.18,14.22 43.18,21.08 42.54,21.72 38.99,21.72 37.85,22.86 34.42,22.86 33.02,24.26 32.51,24.26 31.88,24.89 29.21,24.89 28.45,25.65 27.56,25.65 25.53,23.62 23.62,23.62 23.11,24.13 21.34,24.13 21.08,23.88 v21.08,22.73 | v17.4,18.29 11.68,18.29 v11.3,18.67 | U6.10 14.22,27.27 14.22,26.67 13.21,25.65 10.92,25.65 10.67,25.91 v10.29,25.91 9.53,25.91 8.51,24.89 8.26,24.89 7.62,24.26 7.62,23.37 8.26,22.73 R13.2
DTR_DE  (via drill 0.33)
  Top 0.254: v30.35,6.6 29.85,6.6 28.96,7.49 22.86,7.49 22.1,6.73 20.57,6.73 19.18,8.13 19.18,11.43 18.16,12.45 18.16,14.35 18.67,14.86 18.67,15.75 18.16,16.26 16.89,16.26 16.38,15.75 15.62,15.75 11.68,19.68 10.41,19.68 9.91,20.07 9.91,23.37 11.18,24.64 11.18,26.42 v11.3,26.54
  Bottom 0.254: R17.2 32.73,10.88 31.88,10.03 31.88,8.13 v30.35,6.6 | v11.3,26.54 12.37,26.54 U6.11
DTR_RXD  (via drill 0.33)
  Top 0.254: v27.43,24.38 27.31,24.64 25.53,26.42 25.53,29.21 26.04,29.72 26.04,31.11 25.65,31.5 23.5,31.5 22.61,32.38 22.61,35.94 v22.86,36.2
  Bottom 0.254: R18.2 39.5,20.32 37.59,22.23 34.04,22.23 32.64,23.62 32.13,23.62 31.5,24.26 28.83,24.26 28.58,24.51 27.69,24.51 v27.43,24.38 | v22.86,36.2 22.73,36.32 22.35,36.32 21.34,35.31 21.13,35.31 U6.30
DTR_TXD  (via drill 0.33)
  Top 0.254: v30.23,18.67 30.23,20.07 28.32,21.97 28.32,25.15 26.29,27.18 26.29,28.96 26.8,29.46 26.8,31.37 25.91,32.26 23.88,32.26 23.37,32.77 23.37,35.05 v23.75,35.43
  Bottom 0.203: 43.05,13.34 40.64,13.34
  Bottom 0.254: R16.2 41.4,9.91 41.53,10.03 41.53,10.29 41.91,10.67 U3.4 42.67,11.43 43.31,12.06 43.31,13.08 43.05,13.34 | 40.64,13.34 40,12.7 40,10.79 39.62,10.41 35.18,10.41 34.67,10.92 34.67,11.05 33.91,11.81 32.51,11.81 31.75,12.57 31.75,17.14 v30.23,18.67 | v23.75,35.43 23.5,35.31 22.26,35.31 U6.31
HOST_!CTS
  Bottom 0.254: U6.23 13.46,38.26 13.46,41.78 13.33,41.91 13.33,43.81 J1.36
HOST_!DSR
  Bottom 0.254: U6.24 15.46,39.08 TP9.TP
HOST_!DTR
  Bottom 0.254: U6.32 22.38,34.29 24.38,34.29 TP12.TP
HOST_!RTS  (via drill 0.33)
  Top 0.254: v33.27,30.86 33.91,31.5 35.18,31.5 35.81,32.13 35.81,34.42 36.07,34.67 36.07,40.89 36.45,41.27 38.1,41.27 38.73,41.91 38.73,43.05 39.5,43.81 40.64,43.81 41.91,42.55 J1.11 | v30.73,30.61 30.73,28.16 C11.1
  Bottom 0.254: U6.1 28.11,31.33 28.83,30.61 v30.73,30.61 33.02,30.61 v33.27,30.86
HOST_MISO  (via drill 0.33, 0.41)
  Top 0.254: v39.62,33.53 40.89,32.26 40.89,29.34 v39.88,28.32 | v29.72,36.83 29.97,37.08 29.97,42.42 J1.21 | v44.07,27.69 45.72,27.69 45.85,27.56 45.85,24.89 v47.37,23.37
  Bottom 0.254: v39.88,28.32 40.39,28.83 U2.4 42.93,28.83 v44.07,27.69 | v39.62,33.53 39.37,33.78 38.99,33.78 37.97,34.8 34.67,34.8 34.54,34.92 30.61,34.92 30.23,34.54 29.46,34.54 28.96,35.05 28.96,36.07 v29.72,36.83 | v47.37,23.37 53.21,23.37 54.48,24.64 55.03,24.64 R9.2
HOST_MOSI  (via drill 0.33)
  Top 0.254: v33.91,28.83 33.53,28.83 33.15,29.21 32.26,29.21 31.62,29.84 31.62,31.5 33.66,33.53 33.66,34.92 32.89,35.69 32.89,37.47 33.53,38.1 33.53,40.64 32.38,41.78 J1.19
  Bottom 0.254: v33.91,28.83 U2.11
HOST_RX  (via drill 0.33)
  Top 0.254: v33.27,20.57 35.56,22.86 39.12,22.86 39.37,23.11 39.37,25.53 39.24,25.65 39.12,25.78 38.86,26.04 38.86,26.92 39.37,27.43 40.26,27.43 43.05,30.23 43.05,31.62 42.04,32.64 41.53,32.64 40.77,33.4 40.77,34.29 41.91,35.43 41.91,39.75 v42.54,40.39
  Bottom 0.254: v33.27,20.57 27.69,20.57 25.02,17.91 | 25.02,17.91 23.88,16.76 U1.1 | R4.1 25.11,17.82 25.02,17.91 | v42.54,40.39 43.81,41.66 43.81,43.81 J1.10
HOST_SCK  (via drill 0.33)
  Top 0.254: v36.96,39.62 36.83,39.5 36.83,34.29 36.58,34.04 36.58,32.38 v37.08,31.88
  Bottom 0.254: v36.96,39.62 36.58,40.01 35.94,40.01 34.16,38.23 31.62,38.23 30.1,39.75 29.21,39.75 27.81,41.15 27.81,42.04 J1.23 | v37.08,31.88 36.58,31.37 U2.13
HOST_TX  (via drill 0.33)
  Top 0.254: v48.89,40.39 48.77,40.26 46.99,40.26 46.35,39.62 44.96,39.62 44.2,38.86 44.2,35.43 45.47,34.16 48.39,34.16 50.42,32.13 50.42,28.83 50.29,28.7 50.29,13.21 v49.78,12.7
  Bottom 0.203: 51.18,11.81 55.37,11.81
  Bottom 0.254: 51.18,11.81 50.76,11.39 R24.1 49.78,11.52 v49.78,12.7 | 55.37,11.81 56.01,11.18 U5.4 | J1.8 48.89,43.81 v48.89,40.39
ICP1
  Bottom 0.254: U6.12 13.27,28.57 13.08,28.57 11.94,27.43 10.54,27.43 9.14,28.83 7.11,28.83 6.6,28.32 6.6,27.94 5.97,27.3 5.08,27.3 TP1.TP 4.36,26.58 R33.2
IOREF  (via drill 0.33)
  Top 0.254: v47.62,29.21 47.62,26.29 v47.37,26.04
  Bottom 0.254: R10.1 47.12,30.35 47.5,29.97 47.5,29.34 v47.62,29.21 50.29,29.21 J9.2 50.16,31.88 47.88,31.88 46.48,33.27 R19.1 | v47.37,26.04 47.24,26.16 R11.1
IOREF_ADC6  (via drill 0.33)
  Top 0.254: v14.22,8.13 14.22,8.76 13.97,9.02 13.97,15.37 12.06,17.27 9.78,17.27 7.62,19.43 7.62,24.26 9.14,25.78 9.14,29.84 9.4,30.1 9.4,31.62 10.16,32.38 v10.79,32.38
  Bottom 0.254: C15.1 16.51,6.44 R32.1 | R31.1 16.26,6.18 R32.1 | R32.1 16.55,7.2 15.88,7.87 14.48,7.87 v14.22,8.13 | U6.19 13.33,33.86 13.76,33.86 14.22,33.4 14.22,32.38 13.59,31.75 13.08,31.75 12.45,32.38 v10.79,32.38
LED_BUILTIN
  Top 0.254: D2.K 12.87,27.77 11.94,28.7 TP4.TP
  Bottom 0.254: U6.13 12.26,28.7 TP4.TP
MGR_!RESET  (via drill 0.33)
  Top 0.254: v20.96,36.2 20.96,39.62 20.7,39.88 16.51,39.88 16,40.39 14.99,40.39 13.97,39.37 9.02,39.37 6.48,36.83 J10.5
  Bottom 0.254: U6.29 20.89,36.2 v20.96,36.2 | R27.1 2.9,41.46 D1.A 3.05,39.5 J10.5
MGR_!SS!  (via drill 0.33)
  Top 0.254: v20.32,26.92 19.94,26.54 18.42,26.54 v14.48,30.48
  Bottom 0.254: v20.32,26.92 20.57,26.67 24.64,26.67 25.4,27.43 25.4,28.96 26.16,29.72 27.43,29.72 28.19,28.96 29.76,28.96 R30.1 | U6.14 13.54,31.11 13.84,31.11 v14.48,30.48
MGR_AREF
  Bottom 0.254: U6.20 11.37,37.08 C12.1 10.67,37.21 9.78,37.97 TP5.TP
MGR_MISO
  Bottom 0.254: J10.1 6.98,31.75 7.75,30.99 11.15,30.99 U6.16
MGR_MOSI
  Bottom 0.254: U6.15 11.52,30.23 4.95,30.23 4.45,30.73 4.45,33.02 J10.4
MGR_SCK
  Bottom 0.254: J10.3 6.48,33.53 6.48,33.4 7.49,32.38 9.53,32.38 10.58,33.44 U6.17
MISO
  Bottom 0.254: J9.1 48.13,30.48 46.86,31.75 43.81,31.75 42.16,30.1 U2.3
MOSI
  Bottom 0.203: 42.8,25.65 39.12,25.65
  Bottom 0.254: J9.4 50.29,26.67 48.01,26.67 47.12,27.56 45.63,27.56 R11.2 43.31,26.16 42.8,25.65 | 39.12,25.65 37.21,27.56 U2.10
N$2  (via drill 0.33)
  Top 0.254: C11.2 33.4,27.94 v34.04,27.3
  Bottom 0.254: U2.9 35.05,26.29 v34.04,27.3 33.36,27.3 R30.2
N$3
  Bottom 0.254: J8.7 15.88,2.96 R31.2
N$10  (via drill 0.33)
  Top 0.254: v48.89,45.97 48.89,41.91 48.26,41.27 46.99,41.27 46.1,40.39 44.83,40.39 43.43,38.99 43.43,33.91 v42.8,33.27 44.58,31.5 44.58,30.73 40.39,26.54 v39.75,26.54
  Bottom 0.254: R25.2 49.87,48.22 48.89,47.24 v48.89,45.97 | v42.8,33.27 R19.2 | U2.6 40,26.29 v39.75,26.54
N$11  (via drill 0.33)
  Top 0.254: v51.82,10.03 52.96,11.18 54.99,11.18 v56.26,12.45
  Bottom 0.254: R26.2 47.33,5.75 Q3.3(D) 50.67,6.35 51.31,6.99 51.31,8.89 51.82,9.4 v51.82,10.03 | v56.26,12.45 U5.3
N$15
  Bottom 0.254: Q1.1(G) 25.53,9.19 R7.1
N$18
  Bottom 0.254: 22.29,12.13 22.1,12.32 22.1,13.46 22.61,13.97 U1.3 | 22.29,12.13 23.03,11.39 Q1.3(D) | R5.1 20.66,10.5 22.29,12.13
N$19
  Bottom 0.254: R14.1 41.87,20.19 R18.1
  Bottom 0.305: U3.1 41.91,17.23 R14.1
N$20
  Bottom 0.254: U3.3 40.89,12.7 40.64,12.45 40.64,10.41 39.62,9.4 39.62,6.48 37.97,4.83 35.56,4.83 33.44,6.94 Q2.3(D) 32.64,8.13 33.27,8.76 R17.1
N$22
  Bottom 0.254: Q2.1(G) 33.59,5.02 34.54,4.06 38.44,4.06 R16.1
N$24
  Bottom 0.254: C9.1 24.77,7.24 24.45,6.92 U7.4
N$25
  Bottom 0.305: Q3.1(G) 50.12,9.35 R24.2
N$29  (via drill 0.33)
  Top 0.254: D2.A 14.82,23.79 13.72,24.89 13.72,28.07 11.81,29.97 10.67,29.97 v10.03,29.34
  Bottom 0.254: R34.2 6.22,28.96 6.86,29.59 9.4,29.59 9.65,29.34 v10.03,29.34
NODE5V  (via drill 0.41)
  Top 0.406: J8.4 23.5,3.56 21.97,5.08 v19.94,5.08
  Bottom 0.406: U7.3 20.25,6.92 19.94,6.6 19.94,5.46 20.19,5.21 | 20.19,5.21 20.38,5.02 U7.1 | v19.94,5.08 20.19,5.21
RX
  Bottom 0.254: J4.3 47.88,49.78 47.88,48.81 R25.1
RX_!RE  (via drill 0.33)
  Top 0.254: v24.38,25.15 24,25.53 v24,30.35
  Bottom 0.203: 54.61,14.35 51.56,14.35
  Bottom 0.254: R23.1 58.13,9.61 59.05,10.54 59.05,13.21 58.55,13.72 U5.2 55.24,13.72 54.61,14.35 | 51.56,14.35 48.13,17.91 46.86,17.91 45.59,19.18 44.96,19.18 44.58,19.56 44.58,21.59 43.05,23.11 39.37,23.11 38.35,24.13 34.92,24.13 33.4,25.65 33.02,25.65 32.51,26.16 29.72,26.16 28.32,27.56 27.31,27.56 26.92,27.18 26.92,26.8 25.53,25.4 24.64,25.4 v24.38,25.15 | v24,30.35 23.75,30.61 22.73,30.61 22.35,30.23 21.5,30.23 U6.2
RX_DE  (via drill 0.33)
  Top 0.254: v21.84,25.02 21.97,25.15 21.97,27.94 21.84,28.07 v21.84,38.86
  Bottom 0.254: R26.1 45.85,9.02 46.35,9.53 46.35,10.79 45.72,11.43 44.32,11.43 43.81,11.94 43.81,21.34 42.8,22.35 39.24,22.35 38.1,23.5 34.67,23.5 33.27,24.89 32.77,24.89 32.13,25.53 29.46,25.53 28.58,26.42 27.43,26.42 25.27,24.26 24,24.26 22.99,25.27 22.1,25.27 v21.84,25.02 | v21.84,38.86 20.16,38.86 U6.26
RX_RPU  (via drill 0.33)
  Top 0.254: v52.58,16.26 53.85,14.99 v55.24,14.99 | v42.67,27.56 42.67,27.69 43.56,28.57 45.97,28.57 46.48,28.07 46.48,25.53 48.01,24 49.28,24 49.66,23.62 49.66,19.68 v49.4,19.43
  Bottom 0.254: v42.67,27.56 U2.5 | v49.4,19.43 v52.58,16.26 | v55.24,14.99 U5.1
  Bottom 0.305: U5.1 57.66,15.91 R15.1
SCK
  Bottom 0.203: 42.54,29.46 37.72,29.46
  Bottom 0.254: J9.3 48.26,27.94 47.88,28.32 44.96,28.32 44.23,29.04 R10.2 43.43,30.35 42.54,29.46 | 37.72,29.46 37.08,30.1 U2.12
SCL
  Bottom 0.254: J6.1 6.1,48.9 19.94,48.9 20.7,48.13 R29.2
SCL0  (via drill 0.33)
  Top 0.254: v24.26,48.51 v29.72,48.51 | v43.05,47.5 43.94,46.61 51.18,46.61 v51.43,46.35 | v28.19,37.85 28.19,41.27 28.58,41.66 28.58,43.43 28.96,43.81 30.73,43.81 31.12,44.2 v31.12,45.85
  Bottom 0.254: v43.05,47.5 43.05,48.26 42.42,48.9 30.1,48.9 v29.72,48.51 29.72,47.24 v31.12,45.85 | v51.43,46.35 51.43,43.81 J1.5 | R29.1 23.24,48.13 23.62,48.51 v24.26,48.51 | U6.28 20.64,37.08 27.43,37.08 v28.19,37.85
SDA
  Bottom 0.254: J6.2 8,49.53 25.19,49.53 R28.2
SDA0  (via drill 0.33)
  Top 0.254: v44.45,47.62 44.7,47.37 52.96,47.37 v53.98,46.35 | v28.58,45.97 28.58,44.45 27.94,43.81 26.54,43.81 26.04,43.31 26.04,41.91 26.8,41.15 27.18,41.15 27.56,40.77 27.56,38.86 v27.31,38.61
  Bottom 0.254: v44.45,47.62 44.45,48.9 43.81,49.53 29.21,49.53 28.45,48.77 R28.1 27.9,46.65 v28.58,45.97 | U6.27 20.27,37.85 26.54,37.85 v27.31,38.61 | v53.98,46.35 53.98,43.81 J1.3
SHUTDOWN  (via drill 0.33)
  Top 0.254: S2.2 6.98,18.8 6.86,18.92 6.86,23.88 6.98,24 S2.1 | v7.49,27.94 7.62,28.07 7.62,29.97 7.87,30.23 7.87,33.91 9.02,35.05 11.18,35.05 v14.48,38.35
  Bottom 0.254: R33.1 6.31,24.73 S2.1 6.98,26.42 7.49,26.92 v7.49,27.94 | v14.48,38.35 14.22,38.61 14.22,39.62 J1.31
SWDCLK  (via drill 0.33)
  Top 0.254: v29.21,41.02 29.21,37.59 28.58,36.96 28.58,36.32 29.21,35.69 29.72,35.69 v29.85,35.56
  Bottom 0.254: v29.85,35.56 29.97,35.69 33.91,35.69 34.8,36.58 46.74,36.58 47.12,36.2 49.28,36.2 50.29,35.18 54.23,35.18 J2.1 | J1.22 29.85,44.7 28.58,43.43 28.58,41.66 v29.21,41.02
SWDIO  (via drill 0.33)
  Top 0.254: v35.18,35.69 35.43,35.94 35.43,41.15 36.2,41.91 36.2,43.81 J1.18
  Bottom 0.254: J2.5 54.48,33.15 54.23,33.15 53.85,33.53 49.78,33.53 48.51,34.8 46.48,34.8 46.1,35.18 41.66,35.18 41.27,34.8 40.39,34.8 39.24,35.94 35.43,35.94 v35.18,35.69
TARGET_!RST!  (via drill 0.33)
  Top 0.254: v40.77,35.69 41.15,36.07 41.15,40.26 42.16,41.27 43.18,41.27 43.81,41.91 43.81,43.18 42.54,44.45 J1.12 | v54.36,34.29 54.36,33.91 55.24,33.02 57.15,33.02 J2.6
  Bottom 0.254: v40.77,35.69 41.02,35.69 41.15,35.81 46.48,35.81 46.86,35.43 48.89,35.43 50.04,34.29 v54.36,34.29
TX  (via drill 0.33)
  Top 0.254: v46.35,45.97 46.35,41.78 45.72,41.15 44.58,41.15 42.67,39.24 42.67,34.54 v41.78,33.66 | v25.15,30.48 25.15,29.97 24.77,29.59 24.77,26.16 25.53,25.4 25.53,23.84 R8.2 26.42,23.62 27.43,22.61 27.43,21.72 29.21,19.94 v29.21,18.92 | v37.46,32.89 38.1,32.26 38.1,31.5 37.59,30.99 35.69,30.99 35.31,30.61 v34.29,30.61
  Bottom 0.254: J4.4 v46.35,45.97 | v41.78,33.66 41.18,33.05 U2.1 37.72,32.64 v37.46,32.89 | v34.29,30.61 33.4,29.72 28.58,29.72 27.81,30.48 v25.15,30.48 | v29.21,18.92 29.21,17.02 28.7,16.51 27.31,16.51 26.67,15.88 26.67,14.48 26.92,14.22 26.92,13.34 26.67,13.08 26.67,12.28 R7.2
TX_!RE  (via drill 0.33)
  Top 0.254: v21.72,15.88 21.34,16.26 19.94,16.26 19.05,17.14 19.05,18.92 22.23,22.1 v22.23,22.48 22.23,23.24 20.96,24.51 20.96,25.91 21.21,26.16 21.21,34.67 20.07,35.81 20.07,37.72 v18.8,38.99
  Bottom 0.254: 18.8,38.73 v18.8,38.99 18.8,38.63 U6.25 | R3.2 21.93,21.8 22.23,22.1 v22.23,22.48 | U1.2 22.35,15.24 v21.72,15.88
TX_DE  (via drill 0.33)
  Top 0.254: v8.51,23.88 8.51,19.56 10.16,17.91 12.45,17.91 14.61,15.75 14.61,12.45 15.11,11.94 16.26,11.94 17.27,10.92 v17.27,10.41
  Bottom 0.254: v8.51,23.88 9.65,25.02 13.59,25.02 14.95,26.12 14.99,26.16 14.99,26.9 U6.9 | v17.27,10.41 R5.2
TX_RPU  (via drill 0.33)
  Top 0.254: v39.75,31.37 39.75,29.59 38.86,28.7 38.86,28.19 38.23,27.56 38.23,25.78 38.61,25.4 38.61,23.88 38.23,23.5 34.8,23.5 33.02,21.72 v32.89,21.72 | v24.89,16.26 24.13,17.02 20.7,17.02 20.07,17.65 20.07,19.05 21.72,20.7 v26.42,20.7
  Bottom 0.254: U2.2 v39.75,31.37 | v24.89,16.26 24.77,16.13 24.77,13.34 24.13,12.7 U1.4 | v26.42,20.7 26.67,20.7 28.03,22.06 R6.2 28.03,22.14 28.83,21.34 32.51,21.34 v32.89,21.72
VIN
  Top 0.813: J8.1 33.02,2.54 34.67,4.19 54.86,4.19 58.67,8 58.67,20.7 53.59,25.78 53.59,32.38 50.04,35.94 46.86,35.94 45.72,37.08 U4.1
  Bottom 0.254: R20.1 45.59,37.97 U4.1
VIN_ADC7  (via drill 0.33)
  Top 0.254: v37.97,37.97 v37.97,40.39 | v31.88,39.24 30.99,39.24 30.61,38.86 30.61,36.2 30.86,35.94 30.86,35.18 30.23,34.54 28.19,34.54 25.53,37.21 v25.53,39.62
  Bottom 0.254: R20.2 v37.97,37.97 | 37.97,40.77 38.1,40.89 C4.1 | R21.1 31.41,39.71 v31.88,39.24 32.13,38.99 33.91,38.99 35.81,40.89 37.85,40.89 37.97,40.77 | 37.97,40.77 v37.97,40.39 | U6.22 15.03,35.56 15.37,35.56 16.51,36.7 16.51,38.35 16.76,38.61 16.76,39.5 17.15,39.88 25.27,39.88 v25.53,39.62
XTAL1
  Bottom 0.254: U6.7 18.67,27.4 18.67,26.16 17.53,25.02 16.64,25.02 15.49,23.88 15.49,23.11 | 15.49,23.11 15.49,21.08 16.26,20.32 C13.1 | Y1.1 15.49,23.11
XTAL2
  Bottom 0.254: U6.8 18.03,26.9 18.03,26.42 17.27,25.65 16.38,25.65 14.86,24.13 14.86,23.11 | 14.86,23.11 14.86,21.08 C14.1 | Y1.2 14.86,23.11

### Text on the board
tPlace: SCL | SDA | 0V | 13 | 12 | 11 | 10 | 9 | 8 | 7 | 6 | 5 | 4 | 3 | 2 | TX | RX | MGR / AREF | HOST_!DSR | 0V | SWCLK | SWD / JTAG | MOSI | !RST | RPUpi | SWDIO | SCK | 3V3 | HOST_!DTR | IOREF | MISO | MISO | EPCCS.ORG | SCK | MNG / ICSP | ICP1 | OC1A | 16197^1 | !RESET | MOSI | 0V | 100Ω / TERMINATIONS | +RX | -RX | SHUTDOWN | +DTR | -DTR | +TX | -TX | IOREF | !RESET | 3V3 | 5V | 0V | 0V | VIN | ADC2 | ADC4 | ADC6 | ADC0 | ADC1 | ADC3 | ADC5 | ADC7 | 0V
bPlace: RPUpi | EPCCS.ORG